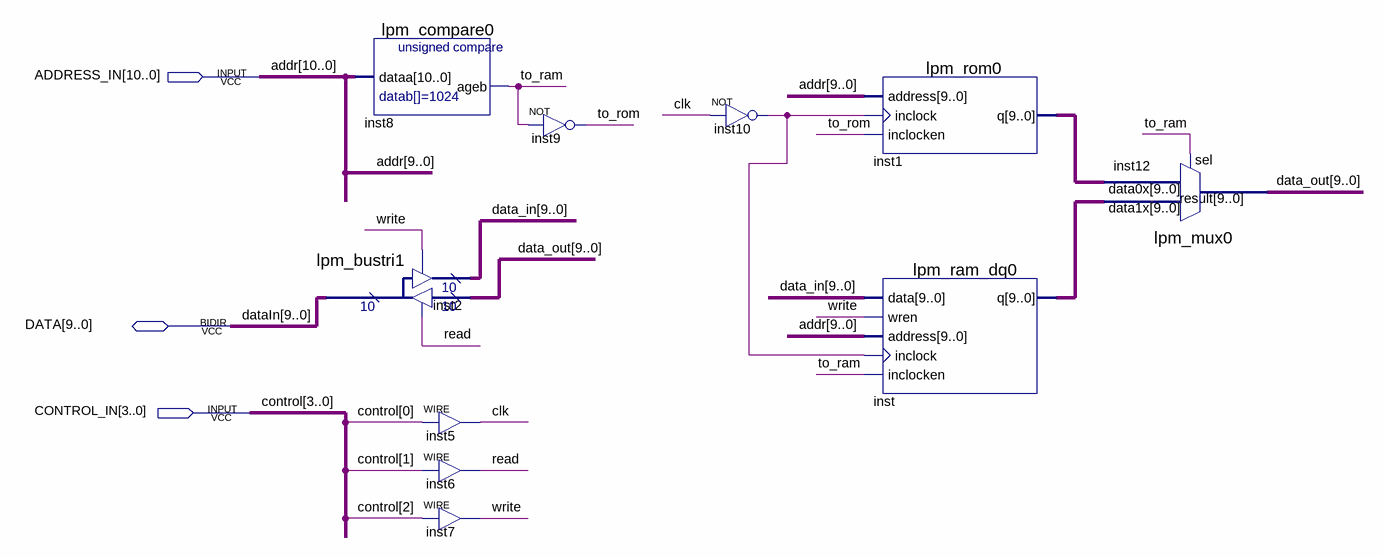
[diagram p0: schematic sheet]
// Quartus schematic Memory.bdf as structural Verilog: 10 symbols, 3 pins
module Memory (
  input  [10:0] ADDRESS_IN,
  input  [3:0] CONTROL_IN,
  inout  [9:0] DATA
);

  wire clk, inst10_out, read, to_ram, to_rom, write;
  wire [9:0] data_in, data_out, inst1_q, inst_q;

  lpm_compare0 inst8 (.dataa(ADDRESS_IN), .ageb(to_ram));
  lpm_bustri1 inst2 (.enabledt(read), .data(data_out), .enabletr(write), .result(data_in), .tridata(DATA));
  assign clk = CONTROL_IN[0];  // WIRE inst5
  assign read = CONTROL_IN[1];  // WIRE inst6
  assign write = CONTROL_IN[2];  // WIRE inst7
  not inst9 (to_rom, to_ram);
  not inst10 (inst10_out, clk);
  lpm_rom0 inst1 (.address(ADDRESS_IN[9:0]), .inclock(inst10_out), .inclocken(to_rom), .q(inst1_q));
  lpm_ram_dq0 inst (
    .data(data_in), .wren(write), .address(ADDRESS_IN[9:0]), .inclock(inst10_out), .inclocken(to_ram),
    .q(inst_q));
  lpm_mux0 inst12 (.data1x(inst_q), .data0x(inst1_q), .sel(to_ram), .result(data_out));

  // Other names for the same wires on the sheet: addr[10:0] = ADDRESS_IN; control[3:0] = CONTROL_IN;
  //   dataIn[9:0] = DATA
endmodule
